# EAGLE design Board Connector (EAGLE 8.3.0)
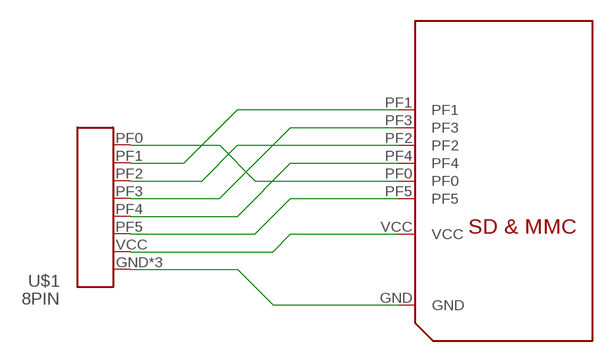
[diagram p0: schematic, sheet 1]

## Parts
U$1  8PIN  [SFV8R-3STBE1HLF]
U$2  SD-MOTHERBOARD-HEADERSNES  [SNES-MOTHERBOARD-HEADER]

## Nets
GND: U$1.GND U$1.GNDP1(GND) U$1.GNDP2(GND) U$2.GND
PF0: U$1.PF0 U$2.PF0
PF1: U$1.PF1 U$2.PF1
PF2: U$1.PF2 U$2.PF2
PF3: U$1.PF3 U$2.PF3
PF4: U$1.PF4 U$2.PF4
PF5: U$1.PF5 U$2.PF5
VCC: U$1.VCC U$2.VCC

## Library data of the parts
U$1 = nintendo-classic:8PIN
U$2 = nintendo-classic:SD-MOTHERBOARD-HEADER

## Board
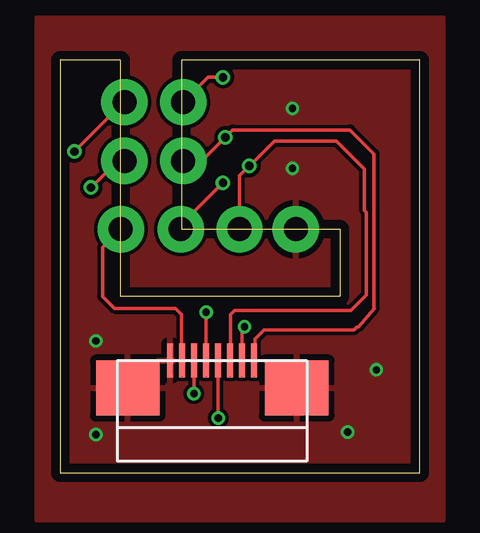
[diagram p1: board, top side]
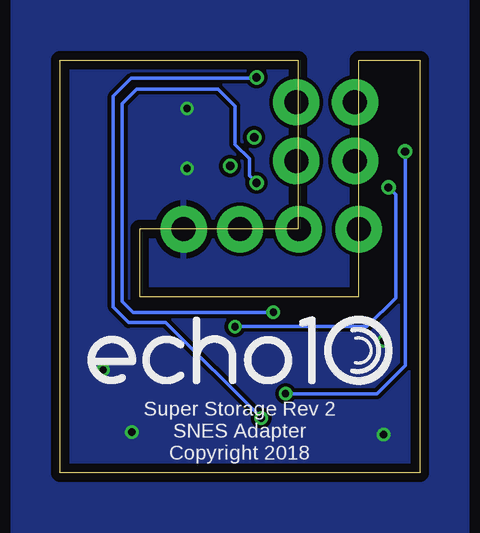
[diagram p2: board, bottom side, seen from below]

Size 15 x 17.22 mm. Coordinates in mm from the lower left corner, seen from the top.
Outline: 0,0 15,0 15,17.22 5.08,17.22 5.08,10.16 11.68,10.16 11.68,7.37 2.54,7.37 2.54,17.22 0,17.22 0,0
Copper layers (1*16): Top 0.035559375mm / dielectric 1.6mm / Bottom 0.035559375mm
Design rules "oshpark-2layer": minimum track width 6mil, minimum drill 10mil, track to track 6mil, track to pad 6mil, pad to pad 6mil, via to via 6mil, smd to smd 6mil, copper to edge 15mil, drill to drill 6mil, minimum pad ring 5mil, minimum via ring 5mil, stop-mask expansion 2.5mil, vias tented up to drill 0mil, thermal gap 10mil

### Footprints (pad centres in the part's own frame; a part is rotated, then mirrored left to right if it is on the bottom)
SFV8R-3STBE1HLF = smd 0.25 x 1.4: GND -1.75,2.15; PF0 1.75,2.15; PF1 1.25,2.15; PF2 0.75,2.15; PF3 0.25,2.15; PF4 -0.25,2.15; PF5 -0.75,2.15; VCC -1.25,2.15 | smd 2.65 x 2.3: GNDP1 -3.525,1; GNDP2 3.525,1
SNES-MOTHERBOARD-HEADER = drill 1 pad 1.93: GND 7.3,0; PF0 2.6,2.85; PF1 0.15,2.85; PF2 4.95,0; PF3 2.6,5.3; PF4 2.5,0; PF5 0.15,5.3; VCC 0,0

### Placement (x,y rotation side)
U$1  6.35,2.54 0 top
U$2  2.54,10.16 0 top

### Tracks (layer width: path | path; a pad name or v marks a point on that pad's centre or on a via)
GND  (via drill 0.3 pad 0.55)
  other vias: 13.2,4.3 12,1.7 9.7,15.2 9.7,12.7 1.5,5.5 1.5,1.6
  pour Top: -1,19 -1,-2 16,-2 16,19
  pour Bottom: -2,20 -2,-3 17,-3 17,20
PF0  (via drill 0.35)
  Top 0.152: U$1.PF0 8.13,4.72 8.13,5.59 8.51,5.97 12.26,5.97 12.39,6.1 12.45,6.1 13.11,6.86 13.1,6.87 13.1,13.3 12.1,14.3 7.2,14.3 v6.9,14 5.91,13.01 U$2.PF0
PF1  (via drill 0.3 pad 0.55, 0.35)
  Top 0.152: v7.7,6.1 7.6,6 U$1.PF1 | U$2.PF1 2.41,13.01 v1.3,11.9
  Bottom 0.152: v7.7,6.1 2.2,6.1 1,7.3 1,11.6 v1.3,11.9
PF2  (via drill 0.35)
  Top 0.152: U$1.PF2 7.11,4.7 7.11,6.6 7.29,6.78 12.14,6.78 12.78,7.42 12.78,10.87 12.7,10.94 12.7,12.68 11.54,13.84 8.94,13.84 v7.9,12.8 7.49,12.39 U$2.PF2
PF3  (via drill 0.3 pad 0.55, 0.35)
  Top 0.152: v6.6,2.29 U$1.PF3 | U$2.PF3 6.18,16.5 v6.8,16.5
  Bottom 0.152: v6.6,2.29 10.59,6.27 12.14,6.27 12.78,6.91 12.78,15.71 12.03,16.46 6.84,16.46 v6.8,16.5
PF4  (via drill 0.3 pad 0.55, 0.35)
  Top 0.152: v6.1,6.7 U$1.PF4 | U$2.PF4 5.04,10.34 v6.8,12.1
  Bottom 0.152: v6.1,6.7 11.95,6.7 12.4,7.15 12.4,15.4 11.8,16 8.4,16 7.7,15.3 7.7,13.7 7.1,13.1 7.1,12.4 v6.8,12.1
PF5  (via drill 0.3 pad 0.55, 0.35)
  Top 0.152: v5.59,3.3 5.6,3.31 U$1.PF5 | U$2.PF5 2.66,15.46 v0.6,13.4
  Bottom 0.152: v5.59,3.3 1.78,3.3 0.6,4.48 v0.6,13.4
VCC
  Top 0.152: U$2.VCC 1.78,9.4 1.78,7.37 2.29,6.86 4.83,6.86 5.08,6.6 5.08,4.71 U$1.VCC

### Text on the board
bPlace: Super Storage Rev 2 / SNES Adapter / Copyright 2018